# Altium schematic sheet STM32L031F6P6.schdoc
size 127 x 101 mm
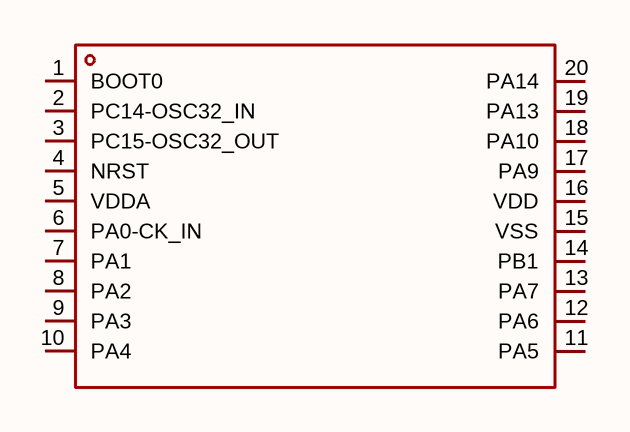
[diagram p0: STM32L031F6P6.schdoc]

## Parts
U?  stm32l031f6p6  [TSSOP-20_L6.5-W4.4-P0.65-LS6.4-BL]  (value not drawn)

## Nets

Not connected (* = marked no-connect by the designer): U? 1(BOOT0) 2(PC14-OSC32_IN) 3(PC15-OSC32_OUT) 4(NRST) 5(VDDA) 6(PA0-CK_IN) 7(PA1) 8(PA2) 9(PA3) 10(PA4) 11(PA5) 12(PA6) 13(PA7) 14(PB1) 15(VSS) 16(VDD) 17(PA9) 18(PA10) 19(PA13) 20(PA14)

## Library data of the parts
U? = stm32l031f6p6: CPU内核:-;CPU最大主频:32MHz;; Manufacturer: ST(意法半导体); AddInBom: yes; ModelId: c491f68934b34c649df5890a1d97cd0f; ModelName: TSSOP-20_L6.5-W4.4-H1.0-LS6.4-P0.65; ModelTransform: 251.969,255.906,0,90,0,0,0.0005,0,0; CPU Maximum Speed: 32MHz; Program Storage Size: 32KB; Program Memory Type: FLASH; Number of I/O: 15; ADC (Bit): 12bit; Voltage - Supply: 1.8V~3.6V; Symbol: STM32L031F6P6; LCSC Part Name: 超低功耗Arm Cortex-M0+ MCU，具有32-KB Flash存储器和32 MHz CPU; SupplierPart: C115208; ManufacturerPart: STM32L031F6P6; Supplier Footprint: TSSOP-20; JLCPCB Part Class: Extended Part; Datasheet: https://item.szlcsc.com/datasheet/STM32L031F6P6/116454.html; Supplier: LCSC; ConvertToPcb: yes; FootprintName: TSSOP-20_L6.5-W4.4-P0.65-LS6.4-BL; CPU Core: -